# EAGLE design plc-accessory (EAGLE 8.6.3)
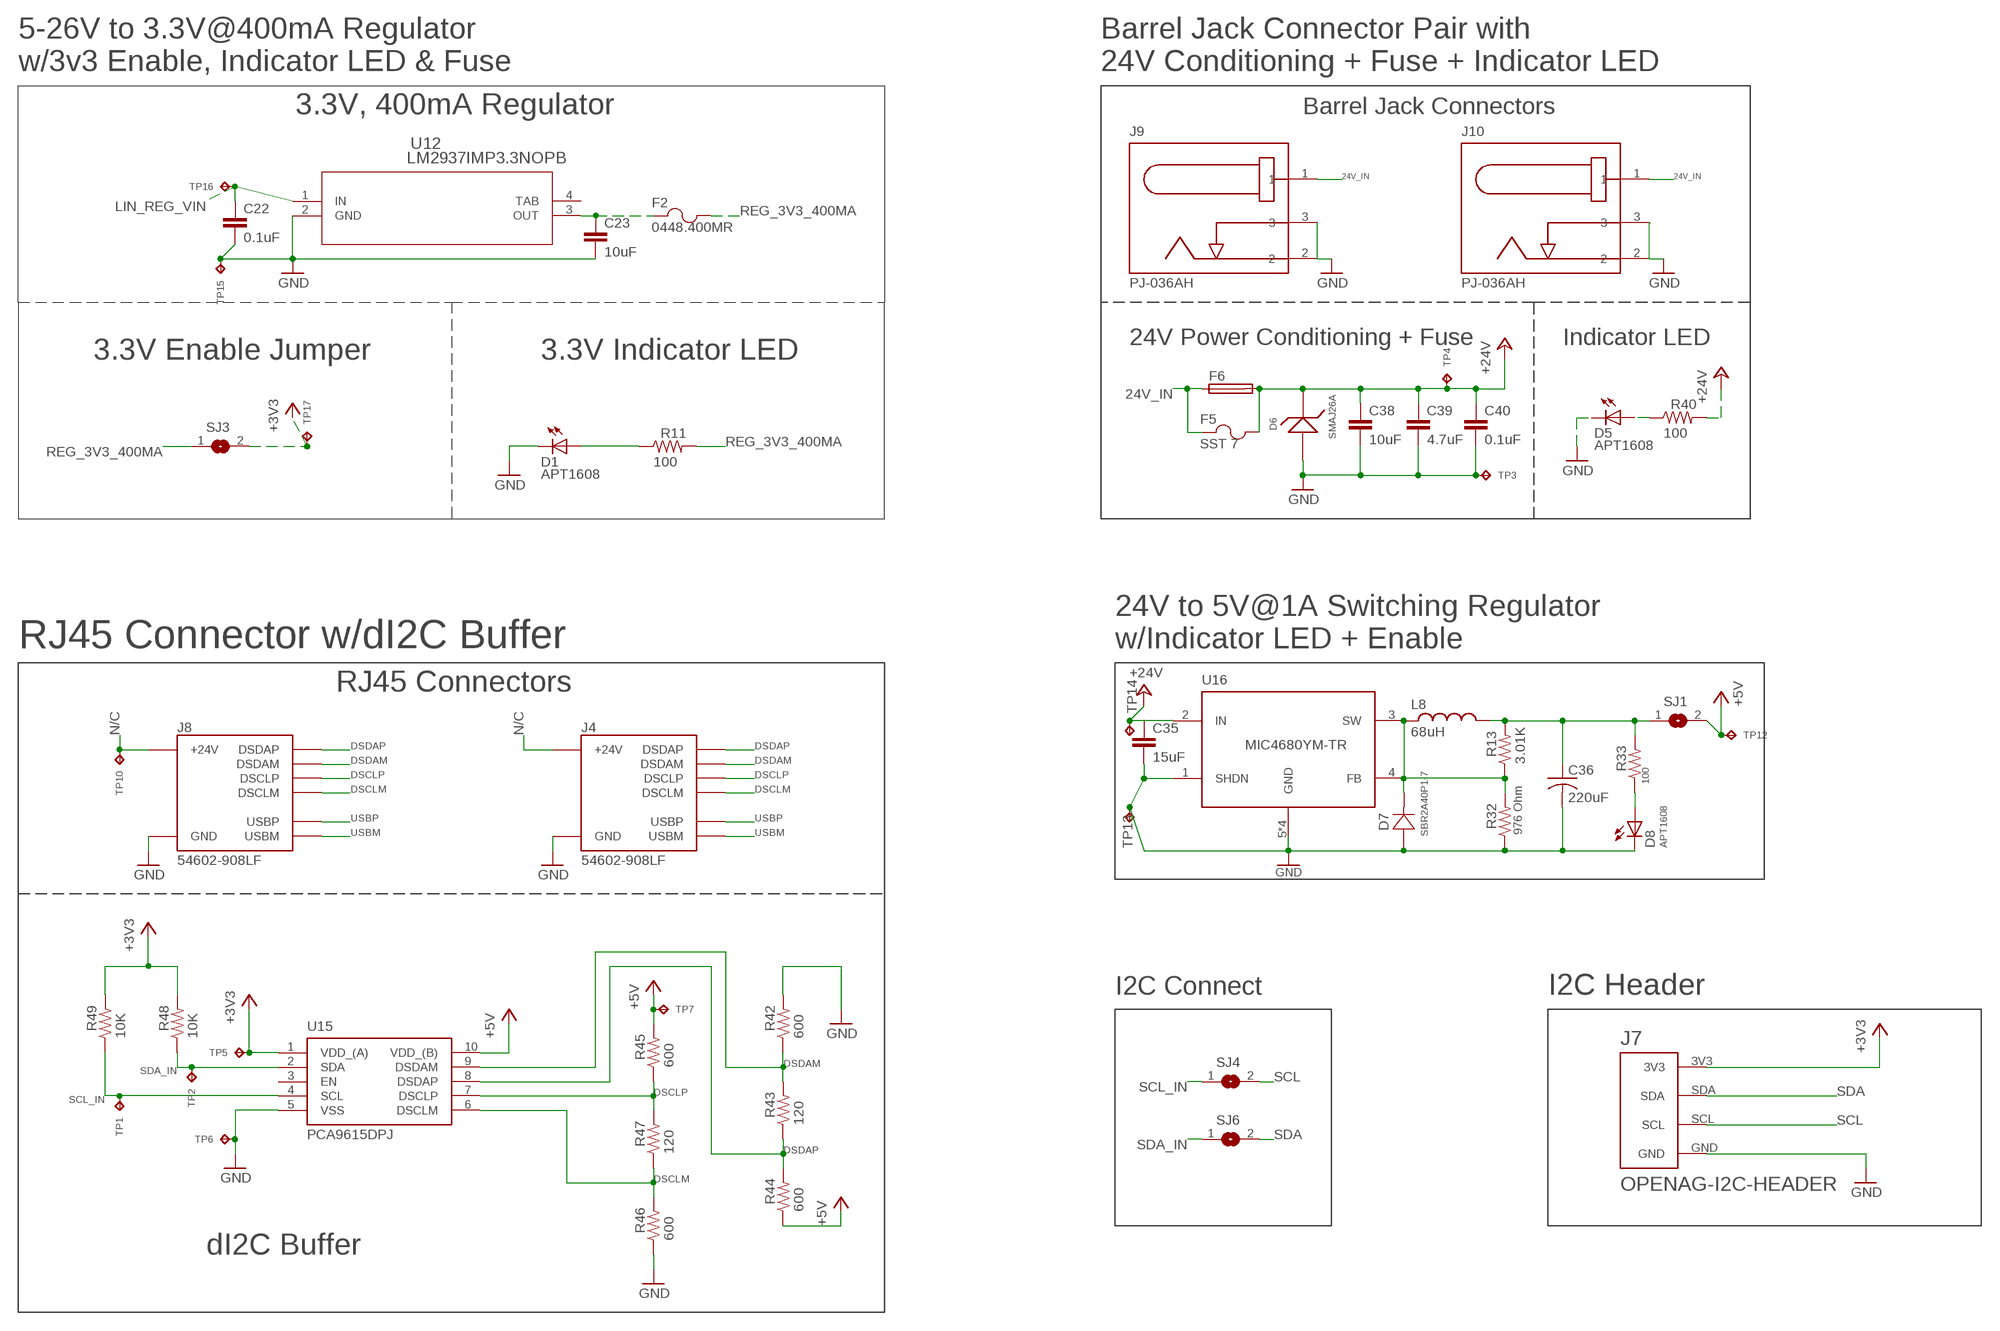
[diagram p0: schematic, sheet 1, part 1 of 2]
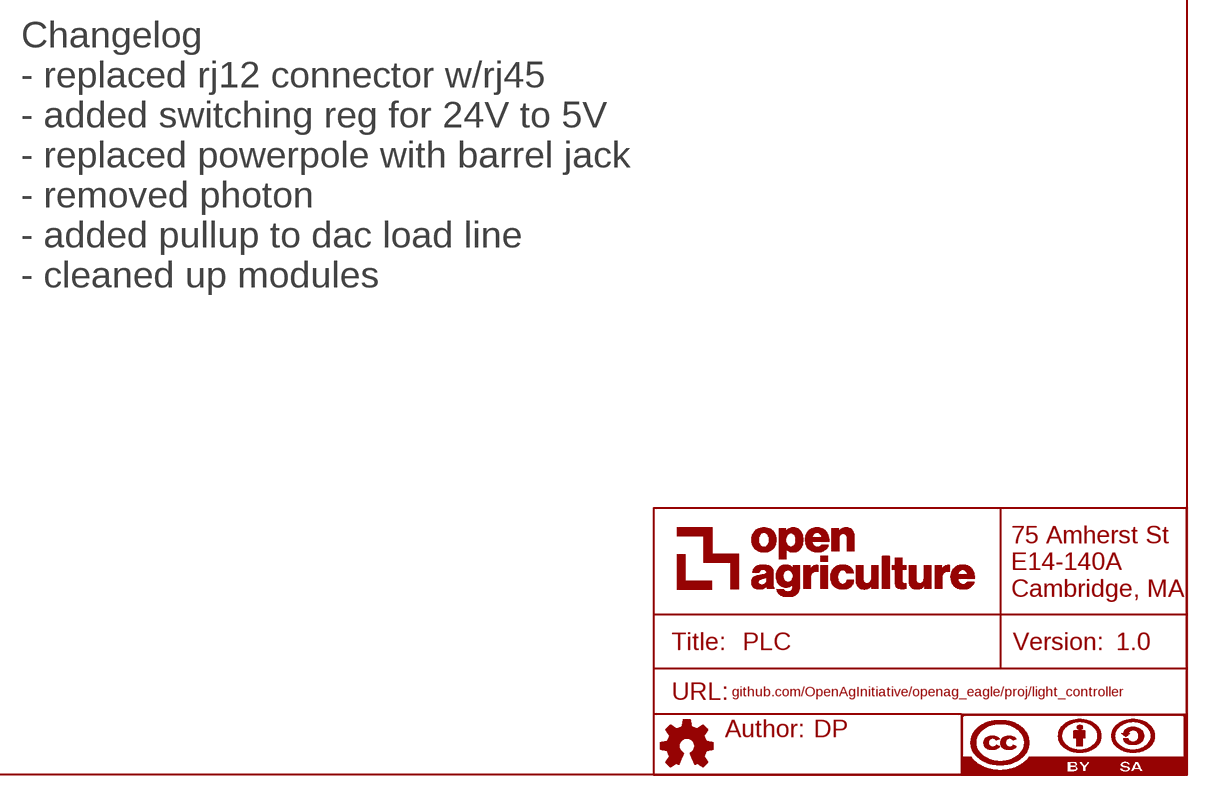
[diagram p1: schematic, sheet 1, part 2 of 2]

## Parts
C22  0.1uF  0.1UF-C0603C104K5RACTU  [C0603]
C23  10uF  10UF-GMK212BBJ106KG-T  [C0805]
C35  15uF  15UF-C2012X5R1V156M125AC  [C0805]
C36  220uF  220UF-TPSY227K010R0100  [CT7343]
C38  10uF  10UF-GMK212BBJ106KG-T  [C0805]
C39  4.7uF  4.7UF-CL21A475KBQNNNE  [C0805]
C40  0.1uF  0.1UF-C0603C104K5RACTU  [C0603]
D1  APT1608  APT1608CGCK  [CHIPLED_0603]
D5  APT1608  APT1608CGCK  [CHIPLED_0603]
D6  SMAJ26A  SMAJ26A-13-F  [SMA]
D7  SBR2A40P1-7  [POWERDI123]
D8  APT1608  APT1608CGCK  [CHIPLED_0603]
F2  0448.400MR  0438.375WR  [0603]
F5  SST 7  SST_7  [SS]
F6  GSH15  [GSH15]
FRAME1  DOCFIELD  [DOCFIELD]
J4  54602-908LF  OPENAG-V1-RJ45PTH  [OPENAG-V1-RJ45]
J7  OPENAG-I2C-HEADER  [OPENAG-I2C-HEADER]
J8  54602-908LF  OPENAG-V1-RJ45PTH  [OPENAG-V1-RJ45]
J9  PJ-036AH  PJ-036AH-SMT-TR  [PJ-036AH]
J10  PJ-036AH  PJ-036AH-SMT-TR  [PJ-036AH]
L8  68uH  68UH-UP2B-680-R  [UP2B]
R11  100  100OHM-RC0603JR-07100RL  [RC0603N]
R13  3.01K  3.01K-RC0603FR-073K01L  [RC0603N]
R32  976 Ohm  982OHM-RC0603FR-07976RL  [RC0603N]
R33  100  100OHM-RC0603JR-07100RL  [RC0603N]
R40  100  100OHM-RC0603JR-07100RL  [RC0603N]
R42  600  600OHM-RC0603FR-07604RL  [RC0603N]
R43  120  120OHM-RC0603FR-07120RL  [RC0603N]
R44  600  600OHM-RC0603FR-07604RL  [RC0603N]
R45  600  600OHM-RC0603FR-07604RL  [RC0603N]
R46  600  600OHM-RC0603FR-07604RL  [RC0603N]
R47  120  120OHM-RC0603FR-07120RL  [RC0603N]
R48  10K  10K-ERJ-3EKF1002V  [RC0603N]
R49  10K  10K-ERJ-3EKF1002V  [RC0603N]
SJ1  SOLDERJUMPERREFLOW_NOPASTE  [SOLDERJUMPER_REFLOW_NOPASTE]
SJ3  SOLDERJUMPERREFLOW_NOPASTE  [SOLDERJUMPER_REFLOW_NOPASTE]
SJ4  SOLDERJUMPERREFLOW_NOPASTE  [SOLDERJUMPER_REFLOW_NOPASTE]
SJ6  SOLDERJUMPERREFLOW_NOPASTE  [SOLDERJUMPER_REFLOW_NOPASTE]
TP1  TPTP06R  [TP06R]
TP2  TPTP06R  [TP06R]
TP3  TPTP06R  [TP06R]
TP4  TPTP06R  [TP06R]
TP5  TPTP06R  [TP06R]
TP6  TPTP06R  [TP06R]
TP7  TPTP06R  [TP06R]
TP10  TPTP06R  [TP06R]
TP12  TPTP06R  [TP06R]
TP13  TPTP06R  [TP06R]
TP14  TPTP06R  [TP06R]
TP15  TPTP06R  [TP06R]
TP16  TPTP06R  [TP06R]
TP17  TPTP06R  [TP06R]
U12  LM2937IMP3.3NOPB  LM2937IMP-3.3/NOPB  [MP04A]
U15  PCA9615DPJ  [SOP50P490X110-10N]
U16  MIC4680YM-TR  [SOIC8]

## Nets
24V_IN: F5.1 F6.1 J9.1 J10.1
+3V3: J7.3V3 R48.2 R49.2 SJ3.2 TP5.TP TP17.TP U15.1(VDD_(A))
+5V: R44.1 R45.2 SJ1.2 TP7.TP TP12.TP U15.10(VDD_(B))
+24V: C35.1 C38.1 C39.1 C40.1 D6.1 F5.2 F6.2 R40.2 TP4.TP TP14.TP U16.2(IN)
DSCLM: J4.DSCLM(5)(DSCLM) J8.DSCLM(5)(DSCLM) R46.2 R47.1 U15.6(DSCLM)
DSCLP: J4.DSCLP(4)(DSCLP) J8.DSCLP(4)(DSCLP) R45.1 R47.2 U15.7(DSCLP)
DSDAM: J4.DSDAM(2)(DSDAM) J8.DSDAM(2)(DSDAM) R42.1 R43.2 U15.9(DSDAM)
DSDAP: J4.DSDAP(1)(DSDAP) J8.DSDAP(1)(DSDAP) R43.1 R44.2 U15.8(DSDAP)
GND: C22.2 C23.2 C35.2 C36.-(2(-)) C38.2 C39.2 C40.2 D1.C D5.C D6.2 D7.- D8.C J4.GND(3)(GND) J7.GND J8.GND(3)(GND) J9.2 J9.3 J10.2 J10.3 R32.1 R42.2 R46.1 TP3.TP TP6.TP TP13.TP TP15.TP U12.2(GND) U15.5(VSS) U16.1(SHDN) U16.5(GND) U16.6(GND) U16.7(GND) U16.8(GND)
LIN_REG_VIN: C22.1 TP16.TP U12.1(IN)
N$10: D1.A R11.1
N$11: D7.+ L8.1 R13.1 R32.2 U16.3(SW) U16.4(FB)
N$12: C23.1 F2.1 U12.3(OUT)
N$22: D8.A R33.1
N$24: C36.+(1(+)) L8.2 R13.2 R33.2 SJ1.1
N$26: D5.A R40.1
N/C: J4.24V(6)(+24V) J8.24V(6)(+24V) TP10.TP
REG_3V3_400MA: F2.2 R11.2 SJ3.1
SCL: J7.SCL SJ4.2
SCL_IN: R49.1 SJ4.1 TP1.TP U15.4(SCL)
SDA: J7.SDA SJ6.2
SDA_IN: R48.1 SJ6.1 TP2.TP U15.2(SDA)
USBM: J4.USBM(8)(USBM) J8.USBM(8)(USBM)
USBP: J4.USBP(7)(USBP) J8.USBP(7)(USBP)
Unconnected: U15.3(EN)

## Notes on the sheet
- 5-26V to 3.3V@400mA Regulator 
  w/3v3 Enable, Indicator LED & Fuse
- Barrel Jack Connector Pair with 
  24V Conditioning + Fuse + Indicator LED
- 3.3V, 400mA Regulator | Barrel Jack Connectors
- 24V Power Conditioning + Fuse | Indicator LED
- 3.3V Enable Jumper | 3.3V Indicator LED
- RJ45 Connector w/dI2C Buffer
- 24V to 5V@1A Switching Regulator
  w/Indicator LED + Enable
- RJ45 Connectors
- I2C Connect | I2C Header
- dI2C Buffer
- Changelog
  - replaced rj12 connector w/rj45
  - added switching reg for 24V to 5V
  - replaced powerpole with barrel jack
  - removed photon
  - added pullup to dac load line
  - cleaned up modules

## Power pins joined to a net without a drawn wire
TAB: U12.4(TAB)

## Library data of the parts
C22 C40 = openag-capacitors:0.1UF-C0603C104K5RACTU: Kemet - C0603C104K5RACTU - CAP CER 0.1UF 50V X7R 0603 Description: 0.1µF ±10% 50V Ceramic Capacitor X7R 0603 (1608 Metric) Technical Specifications: Capacitance: 0.1µF Tolerance: ±10% Rated Voltage: 50V Temperature Coefficient: X7R Operating Temperature: -55°C ~ 125°C Package / Case: 0603 (1608 Metric) Datasheet(s): X7R Dielectric, 6.3-250 VDC <https://search.kemet.com/component-edge/download/datasheet/C0603C104K5RACTU.pdf> Vendor(s): Digikey: 399-5089-1-ND <https://www.digikey.com/product-detail/en/kemet/C0603C104K5RACTU/399-5089-1-ND/1465623>; POPULATE: YES; VERIFIED: NO
C23 C38 = openag-capacitors:10UF-GMK212BBJ106KG-T: Taiyo Yuden - GMK212BBJ106KG-T - CAP CER 10UF 35V X5R 0805 Description: 10µF ±10% 35V Ceramic Capacitor X5R 0805 (2012 Metric) Technical Specifications: Capacitance: 10µF Tolerance: ±10% Rated Voltage: 35V Temperature Coefficient: X5R Operating Temperature: -55°C ~ 85°C Package / Case: 0805 (2012 Metric) Datasheet(s): GMK212BBJ106KG-T Spec <http://ds.yuden.co.jp/TYCOMPAS/ut/detail.do?productNo=GMK212BBJ106KG-T&fileName=GMK212BBJ106KG-T_SS&mode=specSheetDownload> Vendor(s): Digikey: 587-4893-1-ND <https://www.digikey.com/product-detail/en/taiyo-yuden/GMK212BBJ106KG-T/587-4893-1-ND/6563736>; POPULATE: YES; VERIFIED: NO
C35 = openag-capacitors:15UF-C2012X5R1V156M125AC: TDK Corporation - C2012X5R1V156M125AC - CAP CER 15UF 35V X5R 0805 Description: 15µF ±20% 35V Ceramic Capacitor X5R 0805 (2012 Metric) Technical Specifications: Capacitance: 15µF Tolerance: ±20% Voltage - Rated: 35V Temperature Coefficient: X5R Operating Temperature: -55°C ~ 85°C Features: Low ESL Applications: General Purpose Mounting Type: Surface Mount, MLCC Package / Case: 0805 (2012 Metric) Size / Dimension: 0.079" L x 0.049" W (2.00mm x 1.25mm) Thickness (Max): 0.057" (1.45mm) Datasheet(s): C Series, General Datasheet <https://product.tdk.com/info/en/catalog/datasheets/mlcc_commercial_general_en.pdf> MLCC Part Number Guide <https://product.tdk.com/en/products/common/pdf/mlcc_partnumber_description.pdf> C Series, Gen Appl & Mid-Voltage Spec <https://product.tdk.com/info/en/catalog/spec/mlccspec_commercial_general_midvoltage_en.pdf> Vendor(s): Digikey: 445-14423-1-ND <https://www.digikey.com/product-detail/en/tdk-corporation/C2012X5R1V156M125AC/445-14423-1-ND/3956089>
C36 = openag-capacitors:220UF-TPSY227K010R0100: AVX Corporation - TPSY227K010R0100 - CAP TANT 220UF 10V 10% 2917 Description: 220µF Molded Tantalum Capacitors 10V 2917 (7343 Metric) 100 mOhm Technical Specifications: Capacitance: 220µF Tolerance: ±10% Voltage - Rated: 10V Type: Molded ESR (Equivalent Series Resistance): 100 mOhm Operating Temperature: -55°C ~ 125°C Mounting Type: Surface Mount Package / Case: 2917 (7343 Metric) Size / Dimension: 0.287" L x 0.169" W (7.30mm x 4.30mm) Height - Seated (Max): 0.079" (2.00mm) Manufacturer Size Code: Y Features: General Purpose Datasheet(s): TPS Series, Low ESR <http://datasheets.avx.com/TPS.pdf> Vendor(s): Digikey: 478-5408-1-ND <https://www.digikey.com/scripts/DkSearch/dksus.dll?Detail&itemSeq=250948888&uq=636531796868737363>
C39 = openag-capacitors:4.7UF-CL21A475KBQNNNE: Samsung - CL21A475KBQNNNE - CAP CER 4.7UF 50V X5R 0805 Description: 4.7µF ±10% 50V Ceramic Capacitor X5R 0805 (2012 Metric) Technical Specifications: Capacitance: 4.7uF Tolerance: ±10% Rated Voltage: 50V Temperature Coefficient: X5R Operating Temperature: -55°C ~ 85°C Package/Case: 0805 (2012 Metric) Datasheet(s): CL21A475KBQNNNE Characteristics <http://www.samsungsem.com/kr/front/downloadcms.do?path=/kr/support/product-search/mlcc/__icsFiles/afieldfile/2014/11/05&fileName=C_CL21A475KBQNNNE.pdf> Vendor(s): Digikey: 1276-1248-1-ND <https://www.digikey.com/product-detail/en/samsung-electro-mechanics/CL21A475KBQNNNE/1276-1248-1-ND/3889334>; POPULATE: YES; VERIFIED: NO
D1 D5 D8 = openag-diodes:APT1608CGCK: Kingbright - APT1608CGCK - LED GREEN CLEAR 0603 SMD Description: Green 570nm LED Indication - Discrete 2.1V 0603 (1608 Metric) Technical Specifications: Color: Green Lens Color: Colorless Lens Transparency: Clear Millicandela Rating: 50mcd Lens Style/Size: Rectangle with Flat Top, 1.20mm x 0.80mm Voltage - Forward (Vf) (Typ): 2.1V Current - Test: 20mA Viewing Angle: 120° Mounting Type: Surface Mount Wavelength - Dominant: 570nm Wavelength - Peak: 574nm Package / Case: 0603 (1608 Metric) Supplier Device Package: Chip LED Size / Dimension: 1.60mm L x 0.80mm W Height (Max): 0.75mm Datasheet(s): APT1608CGCK <http://www.kingbrightusa.com/images/catalog/SPEC/APT1608CGCK.pdf> Vendor(s): Digikey: 754-1116-1-ND <https://www.digikey.com/product-detail/en/kingbright/APT1608CGCK/754-1116-1-ND/1747833#>; POPULATE: YES; VERIFIED: NO
D6 = openag-diodes:SMAJ26A-13-F: Diodes Incorporated - SMAJ26A-13-F - TVS DIODE 26VWM 42.1VC SMA Description: TVS DIODE 26VWM 42.1VC SMA Technical Specifications: Type: Zener Voltage - Reverse Standoff (Typ): 26V Voltage - Breakdown (Min): 28.9V Voltage - Clamping (Max) @ Ipp: 42.1V Current - Peak Pulse (10/1000µs): 9.5A Power - Peak Pulse: 400W Power Line Protection: No Operating Temperature: -55°C ~ 150°C (TJ) DO-214AC, SMA Datasheet(s): SMAJ5.0(C)A - SMAJ200(C)A Vendor(s): Digikey: SMAJ26A-FDICT-ND <https://www.digikey.com/product-detail/en/diodes-incorporated/SMAJ26A-13-F/SMAJ26A-FDICT-ND/806583>
D7 = openag-diodes:SBR2A40P1-7: Diodes Incorporated - SBR2A40P1-7 - DIODE SBR 40V 2A POWERDI123 Description: Diode Super Barrier 40V 2A Surface Mount PowerDI™ 123 Technical Specifications: Diode Type: Super Barrier Voltage - DC Reverse (Vr) (Max): 40V Current - Average Rectified (Io): 2A Voltage - Forward (Vf) (Max) @ If: 500mV @ 2A Speed: Standard Recovery >500ns, > 200mA (Io) Current - Reverse Leakage @ Vr: 100µA @ 40V Mounting Type: Surface Mount Package / Case: POWERDI®123 Supplier Device Package: PowerDI™ 123 Operating Temperature - Junction: -65°C ~ 150°C Base Part Number: SBR2A40 Datasheet(s): SBR2A40P1 <https://www.diodes.com/assets/Datasheets/SBR2A40P1.pdf> Vendor(s): Digikey: SBR2A40P1DITR-ND <https://www.digikey.com/product-detail/en/diodes-incorporated/SBR2A40P1-7/SBR2A40P1DITR-ND/1681825>
F2 = openag-fuses:0438.375WR: Littelfuse Inc. - 0448.400MR - FUSE BOARD MNT 400MA 125VAC/VDC Description: FUSE BOARD MNT 400MA 125VAC/VDC Technical Specifications: Fuse Type: Board Mount (Cartridge Style Excluded) Current Rating: 400mA Voltage Rating - AC: 125V Voltage Rating - DC: 125V Response Time: Fast Package / Case: 2-SMD, Square End Block Mounting Type: Surface Mount Breaking Capacity @ Rated Voltage: 50A Melting I²t: 0.0416 Approvals: CSA, UL Operating Temperature: -55°C ~ 125°C Size / Dimension: 0.240" L x 0.106" W x 0.106" H (6.10mm x 2.69mm x 2.69mm) DC Cold Resistance: 0.4895 Ohms Datasheet(s): 448 Series Datasheet <http://www.littelfuse.com/~/media/electronics/datasheets/fuses/littelfuse_fuse_448_datasheet.pdf.pdf> Vendor(s): Digikey: F5573CT-ND <https://www.digikey.com/product-detail/en/littelfuse-inc/0448.400MR/F5573CT-ND/3306934>; POPULATE: YES; VERIFIED: YES
F5 = openag-fuses:SST_7: Bel Fuse - SST7 - FUSE BRD MNT 7A 125VAC/VDC 2SMD Description: FUSE BRD MNT 7A 125VAC/VDC 2SMD Technical Specifications: Current Rating: 7A Voltage Rating: 125V Fuse Type: Board Mount (Cartridge Style Excluded) Mounting Type: Surface Mount Operating Temperature: -55°C ~ 125°C Datasheet(s): SST Type <https://belfuse.com/resources/StewartConnector/SST.pdf> Vendor(s): Digikey: 507-1072-1-ND <https://www.digikey.com/product-detail/en/bel-fuse-inc/SST-7/507-1072-1-ND/615026>; POPULATE: YES; VERIFIED: NO
F6 = fuse:GSH15: FUSE HOLDER grid 15mm, 19649 Wickmann; MPN: 64900001039; OC_FARNELL: 1271673; OC_NEWARK: 02P0318
FRAME1 = openag-frames:DOCFIELD: DOCUMENT FIELD; AUTHOR: DP; DESCRIPTION: PLC; TITLE: PLC; URL: github.com/OpenAgInitiative/openag_eagle/proj/light_controller; VER: 1.0
J4 J8 = openag_connector:OPENAG-V1-RJ45: Amphenol FCI - 54602-908LF - CONN MOD JACK 8P8C R/A UNSHLD Description: Jack Modular Connector 8p8c (RJ45, Ethernet) 90� Angle (Right) Unshielded Cat3 Technical Specifications: Connector Type: Jack Number of Positions/Contacts: 8p8c (RJ45, Ethernet) Number of Ports: 1 Number of Rows: 1 Mounting Type: Through Hole Orientation: 90� Angle (Right) Termination: Solder Shielding: Unshielded Ratings: Cat3 Features: Board Lock LED Color: Does Not Contain LED Tab Direction: Down Contact Material: Copper Alloy Contact Finish: Gold Contact Finish Thickness: 15�in (0.38�m) Housing Material: Polyester, Glass Filled Operating Temperature: -40�C ~ 70�C Datasheet(s): 54601-x04(zzz)WPLF Drawing <http://cdn.amphenol-icc.com/media/wysiwyg/files/drawing/c-bmj-0102.pdf> Vendor(s): Digikey: 609-1046-ND <https://www.digikey.com/product-detail/en/amphenol-fci/54602-908LF/609-1046-ND/1001360>; POPULATE: YES; VERIFIED: NO
J7 = openag-connectors:OPENAG-I2C-HEADER: Fits standard 100 mil header footprint; POPULATE: NO; VERIFIED: NO
J9 J10 = openag-connectors:PJ-036AH-SMT-TR: CUI Inc. - PJ-036AH-SMT-TR - CONN PWR JACK 2X5.5MM SOLDER Description: Power Barrel Connector Jack 2.10mm ID (0.083"), 5.50mm OD (0.217") Surface Mount, Right Angle Technical Specifications: Connector Type: Jack Gender: Male Industry Recognized Mating Diameter: 2.10mm ID (0.083"), 5.50mm OD (0.217") Actual Diameter: 0.078" (2.00mm ID), 0.248" (6.30mm OD) Number of Positions/Contacts: 2 Conductors, 3 Contacts Internal Switch(s): Single Switch, Normally Closed Mounting Type: Surface Mount, Right Angle Termination: Solder Shielding: Unshielded Voltage - Rated: 24VDC Current Rating: 5A Mating Length/Depth: 0.360" (9.15mm) Contact Material - Plating: Silver Operating Temperature: -25°C ~ 85°C Housing Material: Polyamide (PA6T), Nylon 6T Contact Material: Brass; Copper Alloy Body Color: Black Datasheet(s): PJ-036AH-SMT-TR <http://www.cui.com/product/resource/digikeypdf/pj-036ah-smt-tr.pdf> Vendor(s): Digikey: CP-036AHPJCT-ND <https://www.digikey.com/product-detail/en/cui-inc/PJ-036AH-SMT-TR/CP-036AHPJCT-ND/1530994>
L8 = openag-inductors:68UH-UP2B-680-R: Eaton - UP2B-680-R - FIXED IND 68UH 1.5A 178.7 MOHM Description: 68µH Unshielded Wirewound Inductor 1.5A 178.7 mOhm Max Nonstandard Technical Specifications: Type: Wirewound Material - Core: Ferrite Inductance: 68µH Tolerance: ±20% Current Rating: 1.5A Current - Saturation: 1.2A Shielding: Unshielded DC Resistance (DCR): 178.7 mOhm Max Operating Temperature: -40°C ~ 85°C Frequency - Test: 100kHz Mounting Type: Surface Mount Package / Case: Nonstandard Size / Dimension: 0.550" L x 0.410" W (13.97mm x 10.41mm) Height - Seated (Max): 0.236" (6.00mm) Datasheet(s): UNI-PAC (-R) <http://www.cooperindustries.com/content/dam/public/bussmann/Electronics/Resources/product-datasheets/BUS_Elx_PM_4308_UNI_PAC_Power_Inductors.pdf> Vendor(s): Digikey: 513-1083-1-ND <https://www.digikey.com/scripts/DkSearch/dksus.dll?Detail&itemSeq=250945518&uq=636531821133403587>
R11 R33 R40 = openag-resistors:100OHM-RC0603JR-07100RL: Yageo - RC0603JR-07100RL - RES SMD 100 OHM 5% 1/10W 0603 Description: 100 Ohms ±5% 0.1W, 1/10W Chip Resistor 0603 (1608 Metric) Moisture Resistant Thick Film Technical Specifications: Resistance: 100 Ohms Tolerance: ±5% Power (Watts): 0.1W, 1/10W Composition: Thick Film Features: Moisture Resistant Temperature Coefficient: ±100ppm/°C Operating Temperature: -55°C ~ 155°C Package / Case: 0603 (1608 Metric) Supplier Device Package: 0603 Size / Dimension: 0.063" L x 0.032" W (1.60mm x 0.80mm) Height - Seated (Max): 0.022" (0.55mm) Number of Terminations: 2 Datasheet(s): Thick Film Chip Resistor Intro <http://www.yageo.com.tw/exep/pages/download/literatures/PYu-R_INT-thick_7.pdf> Chip Resistor Marking <http://www.yageo.com/exep/pages/download/literatures/PYu-R_Marking_2.pdf> RC Series, L Datasheet <http://www.yageo.com/documents/recent/PYu-RC_Group_51_RoHS_L_8.pdf> Vendor(s): Digikey: 311-100GRCT-ND <https://www.digikey.com/product-detail/en/yageo/RC0603JR-07100RL/311-100GRCT-ND/729644>; POPULATE: YES; VERIFIED: NO
R13 = openag-resistors:3.01K-RC0603FR-073K01L: Yageo - RC0603FR-073K01L - RES SMD 3.01K OHM 1% 1/10W 0603 Description: 3.01 kOhms ±1% 0.1W, 1/10W Chip Resistor 0603 (1608 Metric) Moisture Resistant Thick Film Technical Specifications: Resistance: 3.01 kOhms Tolerance: ±1% Power (Watts): 0.1W, 1/10W Composition: Thick Film Features: Moisture Resistant Temperature Coefficient: ±100ppm/°C Operating Temperature: -55°C ~ 155°C Package / Case: 0603 (1608 Metric) Supplier Device Package: 0603 Size / Dimension: 0.063" L x 0.032" W (1.60mm x 0.80mm) Height - Seated (Max): 0.022" (0.55mm) Number of Terminations: 2 Datasheet(s): Chip Resistor Marking <http://www.yageo.com/exep/pages/download/literatures/PYu-R_Marking_2.pdf> RC Series, L Datasheet <http://www.yageo.com/documents/recent/PYu-RC_Group_51_RoHS_L_8.pdf> Vendor(s): Digikey: 311-3.01KHRCT-ND <https://www.digikey.com/scripts/DkSearch/dksus.dll?Detail&itemSeq=250949714&uq=636531832410541188>
R32 = openag-resistors:982OHM-RC0603FR-07976RL: Yageo - RC0603FR-07976RL - RES SMD 976 OHM 1% 1/10W 0603 Description: 976 Ohms ±1% 0.1W, 1/10W Chip Resistor 0603 (1608 Metric) Moisture Resistant Thick Film Technical Specifications: Resistance: 976 Ohms Tolerance: ±1% Power (Watts): 0.1W, 1/10W Composition: Thick Film Features: Moisture Resistant Temperature Coefficient: ±100ppm/°C Operating Temperature: -55°C ~ 155°C Package / Case: 0603 (1608 Metric) Supplier Device Package: 0603 Size / Dimension: 0.063" L x 0.032" W (1.60mm x 0.80mm) Height - Seated (Max): 0.022" (0.55mm) Number of Terminations: 2 Datasheet(s): Chip Resistor Marking <http://www.yageo.com/exep/pages/download/literatures/PYu-R_Marking_2.pdf> RC Series, L Datasheet <http://www.yageo.com/documents/recent/PYu-RC_Group_51_RoHS_L_8.pdf> Vendor(s): Digikey: 311-976HRCT-ND <https://www.digikey.com/scripts/DkSearch/dksus.dll?Detail&itemSeq=250949870&uq=636531835229553061>
R42 R44-R46 = openag-resistors:600OHM-RC0603FR-07604RL: Yageo - RC0603FR-07604RL - RES SMD 604 OHM 1% 1/10W 0603 Description: 604 Ohms ±1% 0.1W, 1/10W Chip Resistor 0603 (1608 Metric) Moisture Resistant Thick Film Technical Specifications: Resistance: 604 Ohms Tolerance: ±1% Power (Watts): 0.1W, 1/10W Composition: Thick Film Features: Moisture Resistant Temperature Coefficient: ±100ppm/°C Operating Temperature: -55°C ~ 155°C Package / Case: 0603 (1608 Metric) Supplier Device Package: 0603 Size / Dimension: 0.063" L x 0.032" W (1.60mm x 0.80mm) Height - Seated (Max): 0.022" (0.55mm) Number of Terminations: 2 Datasheet(s): RC Series, L Datasheet <http://www.yageo.com/documents/recent/PYu-RC_Group_51_RoHS_L_8.pdf> Chip Resistor Marking <http://www.yageo.com/exep/pages/download/literatures/PYu-R_Marking_2.pdf> Vendor(s): Digikey: 311-604HRCT-ND <https://www.digikey.com/product-detail/en/yageo/RC0603FR-07604RL/311-604HRCT-ND/730276>
R43 R47 = openag-resistors:120OHM-RC0603FR-07120RL: Yageo - RC0603FR-07120RL - RES SMD 120 OHM 1% 1/10W 0603 Description: 120 Ohms ±1% 0.1W, 1/10W Chip Resistor 0603 (1608 Metric) Moisture Resistant Thick Film Technical Specifications: Resistance: 120 Ohms Tolerance: ±1% Power (Watts): 0.1W, 1/10W Composition: Thick Film Features: Moisture Resistant Temperature Coefficient: ±100ppm/°C Operating Temperature: -55°C ~ 155°C Package / Case: 0603 (1608 Metric) Supplier Device Package: 0603 Size / Dimension: 0.063" L x 0.032" W (1.60mm x 0.80mm) Height - Seated (Max): 0.022" (0.55mm) Number of Terminations: 2 Datasheet(s): RC Series, L Datasheet <http://www.yageo.com/documents/recent/PYu-RC_Group_51_RoHS_L_8.pdf> Chip Resistor Marking <http://www.yageo.com/exep/pages/download/literatures/PYu-R_Marking_2.pdf> Vendor(s): Digikey: 311-120HRCT-ND <https://www.digikey.com/product-detail/en/yageo/RC0603FR-07120RL/311-120HRCT-ND/729867>
R48 R49 = openag-resistors:10K-ERJ-3EKF1002V: Panasonic - ERJ-3EKF1002V - RES SMD 10K OHM 1% 1/10W 0603 Description: 10 kOhms ±1% 0.1W, 1/10W Chip Resistor 0603 (1608 Metric) Automotive AEC-Q200 Thick Film Technical Specifications: Resistance: 10kOhms Tolerance: ±1% Power: 0.1W, 1/10W Operating Temperature: -55°C ~ 155°C Package/Case: 0603 (1608 Metric) Datasheet(s): ERJ-3EKF1002V View All Specifications <https://industrial.panasonic.com/ww/products/resistors/chip-resistors/general-purpose-chip-resistors/precision-thick-film-chip-resistors/ERJ3EKF1002V> Vendor(s): Digikey: P10.0KHCT-ND <https://www.digikey.com/product-detail/en/panasonic-electronic-components/ERJ-3EKF1002V/P10.0KHCT-ND/198102>; POPULATE: YES; VERIFIED: NO
SJ1 SJ3 SJ4 SJ6 = openag-connectors:SOLDERJUMPER: SMD Solder JUMPER Solder the two pads together to create a connection, or remove the solder to break it. REFLOW - Use this footprint for solder paste and reflow ovens. WAVE - Use this footprint for hand-soldering (larger pads). CLOSED - Has a trace between the two pads to ensure it is closed by default. The trace needs to be cut to disable the jumper, and can be closed again by creating a solder bridge between the two pads.; POPULATE: YES; VERIFIED: NO
TP1-TP7 TP10 TP12-TP17 = openag-testpads:TP: Test pad
U12 = openag-regulators:LM2937IMP-3.3/NOPB: Texas Instruments - LM2937IMP-3.3/NOPB - IC REG LIN 3.3V 400MA SOT223-4 Description: Linear Voltage Regulator IC Positive Fixed 1 Output 3.3V 400mA SOT-223-4 Technical Specifications: Output Configuration: Positive Output Type: Fixed Number of Regulators: 1 Voltage - Input (Max): 26V Voltage - Output (Min/Fixed): 3.3V Voltage Dropout (Max): 1V @ 50mA Current - Output: 400mA Current - Quiescent (Iq): 2mA Current - Supply (Max): 1.25A Protection Features: Over Temperature, Reverse Polarity, Short Circuit Operating Temperature: -40°C ~ 85°C Mounting Type: Surface Mount Package / Case: TO-261-4, TO-261AA Supplier Device Package: SOT-223-4 Base Part Number: LM2937 Datasheet(s): LM2937-2.5, LM2937-3.3 Datasheet <http://www.ti.com/lit/ds/symlink/lm2937-2.5.pdf> Vendor(s): Digikey: LM2937IMP-3.3/NOPBCT-ND <https://www.digikey.com/product-detail/en/texas-instruments/LM2937IMP-3.3-NOPB/LM2937IMP-3.3-NOPBCT-ND/270742#>; POPULATE: YES; VERIFIED: NO
U15 = openag-buffers:PCA9615DPJ: NXP USA Inc. - PCA9615DPJ - IC REDRIVER I2C 2CH 10TSSOP Description: Buffer, ReDriver 2 Channel 400kHz 10-TSSOP Technical Specifications: Type: Buffer, ReDriver Applications: I²C Input: 2-Wire Bus Output: 2-Wire Bus Data Rate (Max): 400kHz Number of Channels: 2 Capacitance - Input: 7pF Voltage - Supply: 2.3 V ~ 5.5 V Current - Supply: 16µA Operating Temperature: -40°C ~ 85°C Package / Case: 10-TFSOP, 10-MSOP (0.118", 3.00mm Width) Supplier Device Package: 10-TSSOP Base Part Number: PCA9615 Datasheet(s): PCA9615DP <http://www.nxp.com/documents/data_sheet/PCA9615.pdf> Vendor(s): Digikey: 568-11484-1-ND <https://www.digikey.com/product-detail/en/nxp-usa-inc/PCA9615DPJ/568-11484-1-ND/4864508>
U16 = openag-regulators:MIC4680YM-TR: Microchip Technology - MIC4680YM-TR - IC REG BUCK BOOST ADJ 1.3A 8SOIC Description: Buck, Buck-Boost Switching Regulator IC Positive Adjustable 1.23V 1 Output 1.3A 8-SOIC (0.154", 3.90mm Width) Technical Specifications: Function: Step-Down, Step-Up/Step-Down Output Configuration: Positive Topology: Buck, Buck-Boost Output Type: Adjustable Number of Outputs: 1 Voltage - Input (Min): 4V Voltage - Input (Max): 34V Voltage - Output (Min/Fixed): 1.23V Voltage - Output (Max): 32.98V Current - Output: 1.3A Frequency - Switching: 200kHz Synchronous Rectifier: No Operating Temperature: -40°C ~ 125°C (TJ) Mounting Type: Surface Mount Package / Case: 8-SOIC (0.154", 3.90mm Width) Supplier Device Package: 8-SOIC Base Part Number: MIC4680 Datasheet(s): MIC4680 <http://www.microchip.com/mymicrochip/filehandler.aspx?ddocname=en579250> Vendor(s): Digikey: 576-1222-1-ND <https://www.digikey.com/scripts/DkSearch/dksus.dll?Detail&itemSeq=250950999&uq=636531791983475304>

## Board
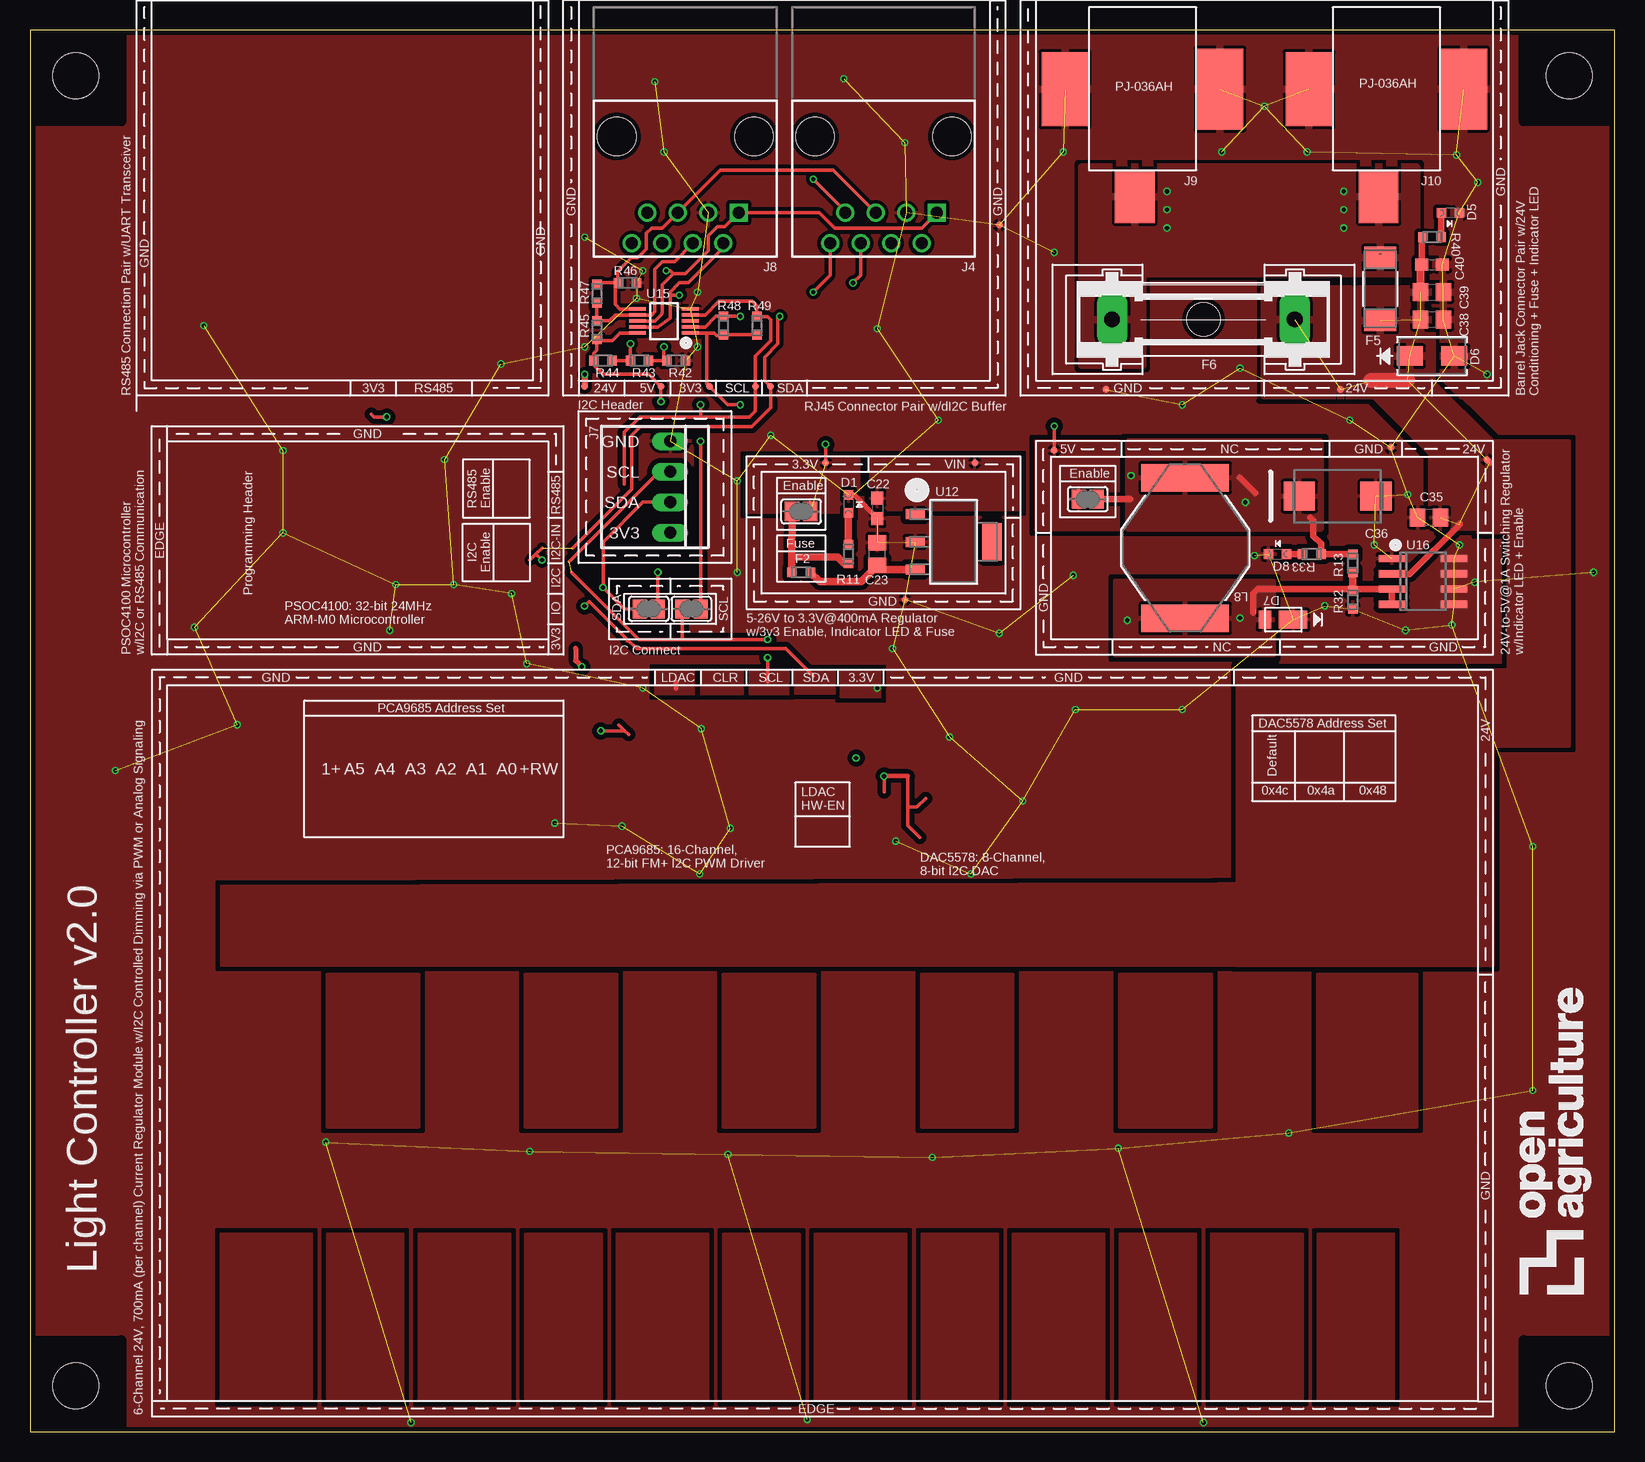
[diagram p2: board, top side]
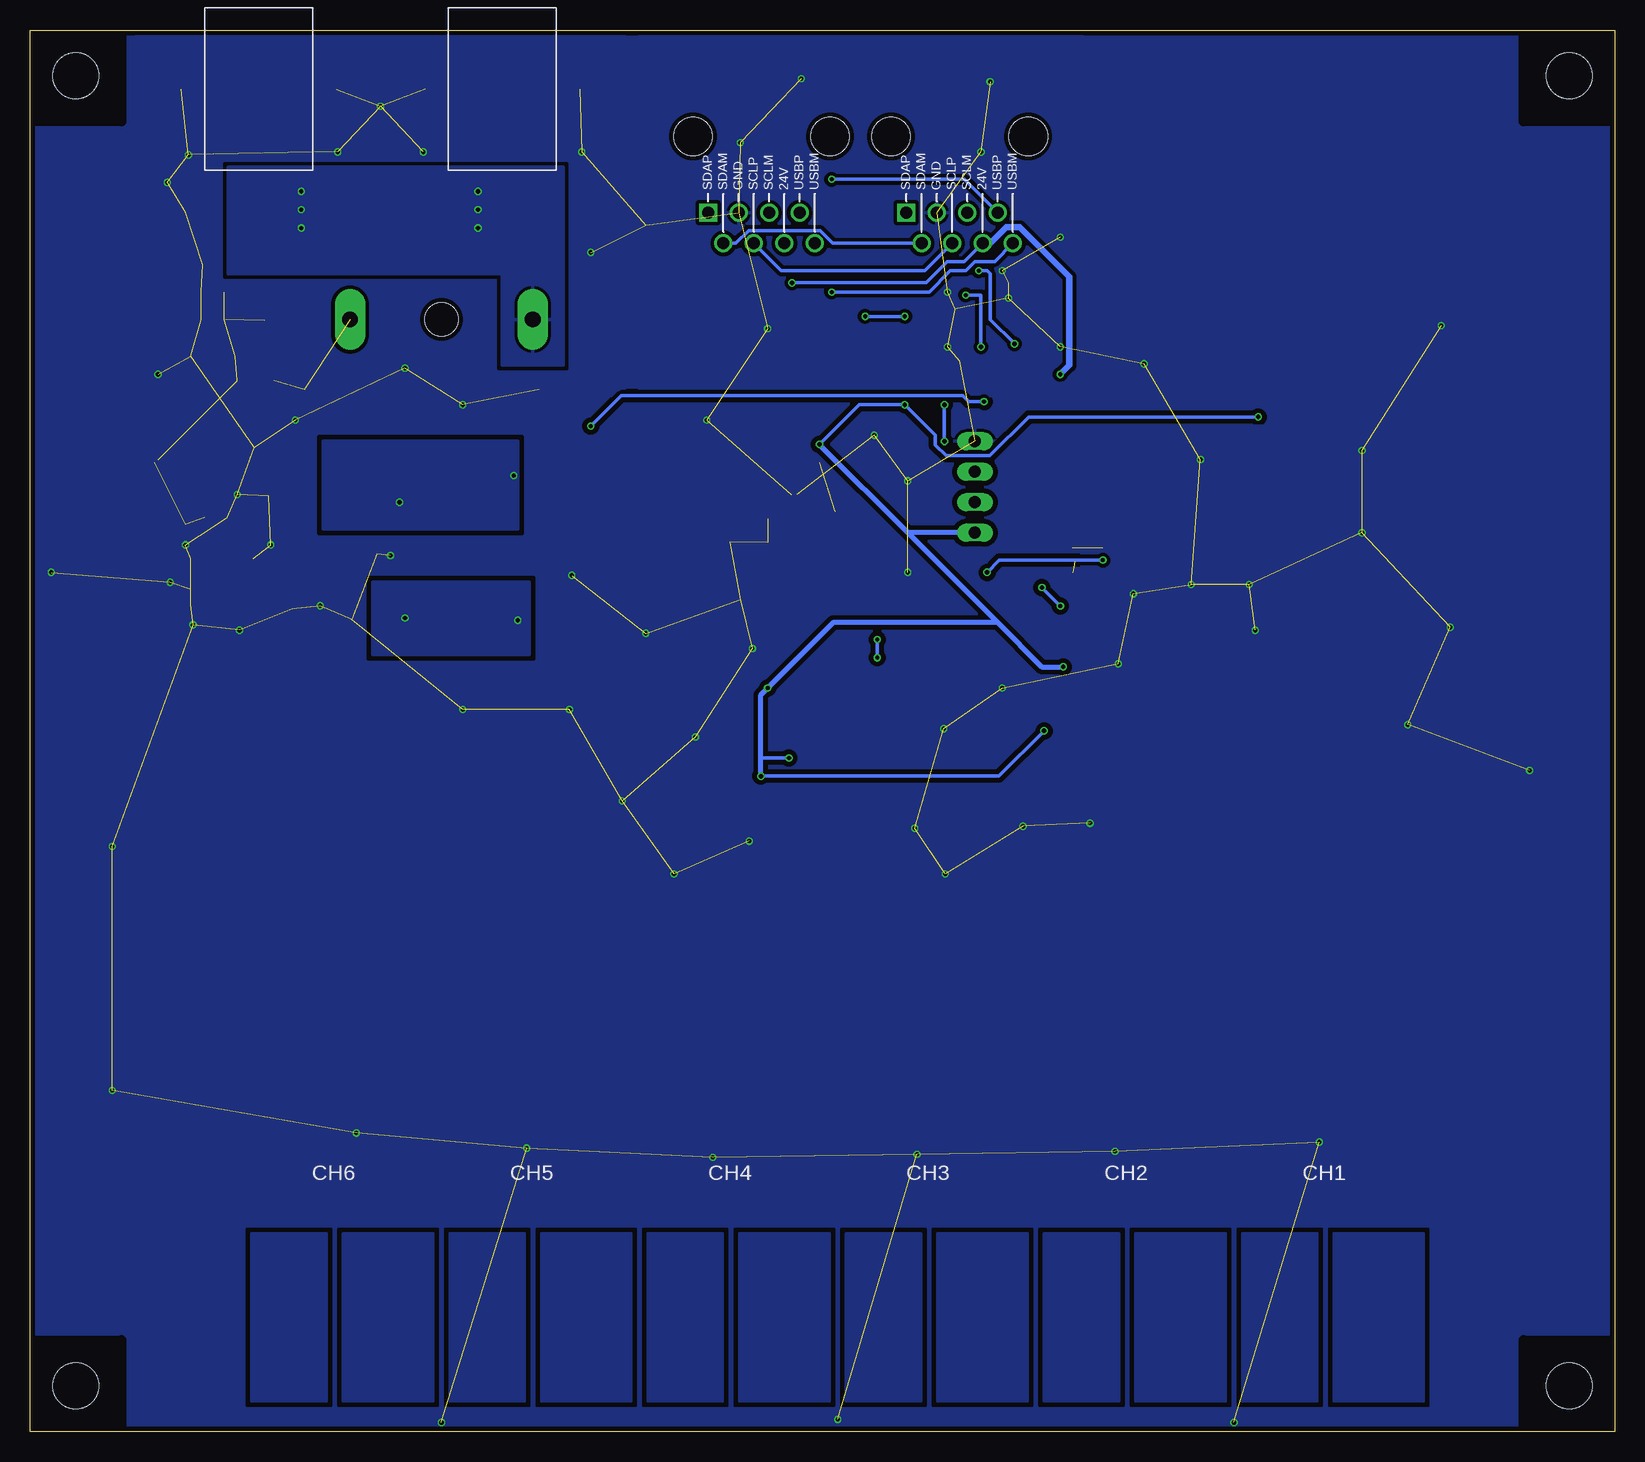
[diagram p3: board, bottom side, seen from below]

Size 132.08 x 116.84 mm. Coordinates in mm from the lower left corner, seen from the top.
Outline: 0,0 132.08,0 132.08,116.84 0,116.84 0,0
Copper layers (1*16): Top 0.035559375mm / dielectric 1.6mm / Bottom 0.035559375mm
Design rules "openag-router": minimum track width 6mil, minimum drill 10mil, track to track 12mil, track to pad 12mil, pad to pad 12mil, via to via 12mil, smd to smd 12mil, copper to edge 15mil, drill to drill 6mil, minimum pad ring 5mil, minimum via ring 5mil, stop-mask expansion 2.5mil, vias tented up to drill 20mil, thermal gap 10mil

### Footprints (pad centres in the part's own frame; a part is rotated, then mirrored left to right if it is on the bottom)
C0603 = smd 1.1 x 1: 1 -0.85,0; 2 0.85,0
C0805 = smd 1.3 x 1.5: 1 -0.95,0; 2 0.95,0
CT7343 = smd 2.6 x 2.4: + -3.2,0; - 3.2,0
CHIPLED_0603 = smd 0.8 x 0.8: A 0,-0.75; C 0,0.75
SMA = smd 2.18 x 1.63: 1 -1.857,0; 2 1.857,0
POWERDI123 = smd 1.05 x 1.5: + -1.3,0 | smd 2.4 x 1.5: - 1.05,0
0603 = smd 0.756 x 0.8: 1 -0.778,0; 2 0.778,0
SS = smd 1.803 x 2.642: 1 -2.629,0; 2 2.629,0
GSH15 = drill 1.321 pad 2.54 long: 1 -7.62,0; 2 7.62,0 | hole 2.794: 0,0
OPENAG-V1-RJ45 = drill 1: 24V(6) 1.905,8.89; DSCLM(5) 0.635,6.35; DSCLP(4) -0.635,8.89; DSDAM(2) -3.175,8.89; GND(3) -1.905,6.35; USBM(8) 4.445,8.89; USBP(7) 3.175,6.35 | drill 1 square: DSDAP(1) -4.445,6.35 | hole 3.2: -5.715,0; 5.715,0
OPENAG-I2C-HEADER = drill 1 long: 3V3 3.81,0; GND -3.81,0; SCL -1.27,0; SDA 1.27,0
PJ-036AH = smd 4.4 x 3.3: 1 2.2,-0.65 | smd 6.75 x 3.9: 2 -6.75,6.45 | smd 6.2 x 3.9: 3 -6.75,-6.45
UP2B = smd 2.311 x 7.29: 1 -5.855,0; 2 5.855,0
RC0603N = smd 0.756 x 0.8: 1 -0.778,0; 2 0.778,0
SOLDERJUMPER_REFLOW_NOPASTE = smd 1.168 x 1.6: 1 -0.762,0; 2 0.762,0
TP06R = smd 0.6 x 0.6: TP 0,0
MP04A = smd 1.6 x 0.838: 1 -3.2,2.3; 2 -3.2,0; 3 -3.2,-2.3 | smd 1.6 x 3.099: 4 3.2,0
SOP50P490X110-10N = smd 1.4 x 0.3: 1 -2.2,1; 2 -2.2,0.5; 3 -2.2,0; 4 -2.2,-0.5; 5 -2.2,-1; 6 2.2,-1; 7 2.2,-0.5; 8 2.2,0; 9 2.2,0.5; 10 2.2,1
SOIC8 = smd 0.6 x 2.2: 1 -1.905,-2.6; 2 -0.635,-2.6; 3 0.635,-2.6; 4 1.905,-2.6; 5 1.905,2.6; 6 0.635,2.6; 7 -0.635,2.6; 8 -1.905,2.6
OPENAG-CORNER-MOUNTING-HOLE = hole 3.81: 0,0

### Placement (x,y rotation side)
C22  70.61,76.96 270 top
C23  70.61,73.15 90 top
C35  116.59,76.2 180 top
C36  108.97,77.98 0 top
C38  116.84,92.71 0 top
C39  116.84,95 0 top
C40  116.84,97.28 0 top
D1  68.2,77.34 0 top
D5  118.36,101.6 270 top
D6  116.84,89.66 0 top
D7  104.2,67.69 0 top
D8  103.95,73.15 90 top
F2  64.26,71.63 180 top
F5  112.52,95.25 270 top
F6  97.79,92.71 0 top
FRAME1  178.82,50.16 0 bottom  (outside the outline)
J4  71.12,107.95 180 top
J7  53.34,78.74 270 top
J8  54.61,107.95 180 top
J9  92.71,105.16 270 top
J10  113.03,105.16 270 top
L8  96.27,73.66 90 top
R11  68.2,73.15 270 top
R13  110.24,72.39 90 top
R32  110.24,69.34 90 top
R33  106.81,73.15 0 top
R40  116.84,99.57 180 top
R42  53.85,89.28 0 top
R43  50.8,89.28 0 top
R44  47.75,89.28 0 top
R45  47.24,91.82 270 top
R46  49.78,95.76 180 top
R47  47.24,94.87 270 top
R48  57.78,92.2 270 top
R49  60.58,92.2 270 top
SJ1  88.14,77.72 180 top
SJ3  64.26,76.71 0 top
SJ4  55.12,68.58 180 top
SJ6  51.56,68.58 180 top
TP1  60.45,87.12 270 top
TP2  61.72,87.12 270 top
TP3  89.66,86.87 180 top
TP4  109.22,86.87 180 top
TP5  56.64,87.12 270 top
TP6  80.77,100.58 270 top
TP7  52.58,87.12 270 top
TP10  46.23,87.12 270 top
TP12  85.34,81.79 0 top
TP13  113.41,82.04 0 top
TP14  121.41,81.03 0 top
TP15  72.9,69.34 0 top
TP16  78.74,80.77 0 top
TP17  66.29,80.77 0 top
U12  76.96,74.17 0 top
U15  52.83,92.58 180 top
U16  116.08,70.87 270 top
U$1  [OPENAG-CORNER-MOUNTING-HOLE]  3.81,3.81 0 top
U$2  [OPENAG-CORNER-MOUNTING-HOLE]  128.27,3.81 90 top
U$3  [OPENAG-CORNER-MOUNTING-HOLE]  128.27,113.03 180 top
U$4  [OPENAG-CORNER-MOUNTING-HOLE]  3.81,113.03 270 top
U$5  [OPENAG-LOGO-1000-MIL]  129.54,11.43 90 top

### Tracks (layer width: path | path; a pad name or v marks a point on that pad's centre or on a via)
24V_IN  (via drill 0.35)
  other vias: 109.47,100.33 109.47,101.85 109.47,103.38 94.74,103.38 94.74,100.33 94.74,101.85
  pour Top (isolate 0.305): 87.63,88.9 87.63,105.41 115.57,105.41 115.57,96.52 92.71,96.52 92.71,88.9
  pour Bottom (isolate 0.305): 115.57,105.41 87.63,105.41 87.63,88.9 92.71,88.9 92.71,96.52 115.57,96.52
!LDAC!
  Top 0.406: 53.85,61.98 53.85,62.48
  pour Top (isolate 0.406): 55.37,61.47 55.37,63.5 52.07,63.5 52.07,61.47
+3V3  (via drill 0.35)  (1 unrouted)
  Top 0.305: 49.88,58.12 49.58,58.42 | 49.58,58.42 v47.57,58.42 | 49.08,58.92 49.58,58.42 | v71.17,54.63 71.17,53.3 | U15.1 56.39,91.58 | 56.39,91.58 57.01,91.58 57.24,91.35 57.71,91.35 R48.2 R49.2 | 56.39,91.58 56.39,87.38 TP5.TP 58.17,85.6 v59.18,85.6 | v66.29,82.3 TP17.TP | v29.72,84.58 28.7,84.58 28.45,84.84 | 73.15,52.07 73.15,50.55 74.16,49.54 | 73.15,52.07 73.15,54.65 | 73.15,52.07 73.91,52.07 74.64,52.79
  Top 0.356: 73.15,54.65 71.18,54.65 v71.17,54.63
  Top 0.406: v47.57,58.41 v47.57,58.42 | v45.97,63.75 45.47,64.26 45.47,65.28
  Bottom 0.305: v47.57,58.42 51.36,54.63 v71.17,54.63 | v66.29,82.3 62.99,85.6 v59.18,85.6 56.64,83.06 56.64,82.24 55.75,81.34 52.09,81.34 48.85,84.58 v29.72,84.58 | v68.83,56.15 71.15,56.15 71.17,56.13
  Bottom 0.406: v71.17,54.63 71.17,56.13 71.17,61.42 v70.61,61.98 65.15,67.44 51.44,67.44 | v45.97,63.75 47.75,63.75 51.44,67.44 | v66.29,82.3 58.93,74.93 | 58.93,74.93 51.44,67.44 | J7.3V3 58.93,74.93
  pour Top (isolate 0.406): 67.56,63.5 70.87,63.5 70.87,61.21 67.56,61.21
  pour Top: 69.09,81.28 69.09,76.58 59.69,76.58 59.69,81.28
+5V  (via drill 0.35)
  Top 0.305: U15.10 49.16,91.58 48.51,90.93 47.28,90.93 R45.2 47.24,90.17 46.97,89.9 R44.1 46.97,88.92 47.75,88.14 51.56,88.14 TP7.TP v52.58,85.85 | v85.34,83.82 TP12.TP
  Bottom 0.305: v52.58,85.85 53.85,85.85 54.36,86.36 82.8,86.36 v85.34,83.82
  pour Top (isolate 0.305): 83.82,75.18 90.68,75.18 90.68,82.55 83.82,82.55
+24V  (9 unrouted)
  Top 0.559: C40.1 115.99,99.57 R40.2 | U16.2 115,71.5 119.13,75.63 119.13,75.69 | 121.67,80.77 TP14.TP
  Top 0.66: C39.1 115.89,97.28 C40.1
  Top 1.27: 114.81,87.63 111.76,87.63
  pour Top (isolate 0.406): 115.57,38.86 115.57,45.72 15.88,45.47 15.88,38.86
  pour Top (isolate 0.406): 100.58,63.5 100.58,38.86 121.92,38.86 121.92,63.5
  pour Top (isolate 0.305): 102.87,86.36 102.87,95.25 116.84,95.25 116.84,86.36
  pour Top: 121.92,82.55 116.65,82.55 116.65,75.25 121.92,75.25
  pour Top (isolate 0.305): 116.84,81.28 121.92,81.28 121.92,82.55
  pour Top (isolate 0.305): 111.76,86.36 116.84,81.28 121.92,81.28 121.92,82.55 116.84,87.63 111.76,87.63
  pour Top (isolate 0.305): 120.65,82.55 120.65,74.93 123.19,74.93 123.19,63.5 120.65,63.5 120.65,57.15 128.27,57.15 128.27,82.55
CH1+
  pour Bottom (isolate 0.406): 24.77,2.54 24.77,16.51 31.11,16.51 31.11,2.54
  pour Top (isolate 0.406): 24.77,2.54 24.77,16.51 31.11,16.51 31.11,2.54
CH1-
  pour Top (isolate 0.406): 15.88,2.54 15.88,16.51 23.5,16.51 23.5,2.54
  pour Bottom (isolate 0.406): 15.88,2.54 15.88,16.51 23.5,16.51 23.5,2.54
CH2+
  pour Bottom (isolate 0.406): 41.27,2.54 41.27,16.51 47.62,16.51 47.62,2.54
  pour Top (isolate 0.406): 41.27,2.54 41.27,16.51 47.62,16.51 47.62,2.54
CH2-
  pour Top (isolate 0.406): 32.38,2.54 32.38,16.51 40.01,16.51 40.01,2.54
  pour Bottom (isolate 0.406): 32.38,2.54 32.38,16.51 40.01,16.51 40.01,2.54
CH3+
  pour Bottom (isolate 0.406): 57.78,2.54 57.78,16.51 64.14,16.51 64.14,2.54
  pour Top (isolate 0.406): 57.78,2.54 57.78,16.51 64.14,16.51 64.14,2.54
CH3-
  pour Top (isolate 0.406): 48.9,2.54 48.9,16.51 56.52,16.51 56.52,2.54
  pour Bottom (isolate 0.406): 48.9,2.54 48.9,16.51 56.52,16.51 56.52,2.54
CH4+
  pour Bottom (isolate 0.406): 74.3,2.54 74.3,16.51 80.64,16.51 80.64,2.54
  pour Top (isolate 0.406): 74.3,2.54 74.3,16.51 80.64,16.51 80.64,2.54
CH4-
  pour Top (isolate 0.406): 65.41,2.54 65.41,16.51 73.03,16.51 73.03,2.54
  pour Bottom (isolate 0.406): 65.41,2.54 65.41,16.51 73.03,16.51 73.03,2.54
CH5+
  pour Bottom (isolate 0.406): 90.81,2.54 90.81,16.51 97.16,16.51 97.16,2.54
  pour Top (isolate 0.406): 90.81,2.54 90.81,16.51 97.16,16.51 97.16,2.54
CH5-
  pour Top (isolate 0.406): 81.92,2.54 81.92,16.51 89.53,16.51 89.53,2.54
  pour Bottom (isolate 0.406): 81.92,2.54 81.92,16.51 89.53,16.51 89.53,2.54
CH6+
  pour Bottom (isolate 0.406): 107.31,2.54 107.31,16.51 113.67,16.51 113.67,2.54
  pour Top (isolate 0.406): 107.31,2.54 107.31,16.51 113.67,16.51 113.67,2.54
CH6-
  pour Top (isolate 0.406): 98.42,2.54 98.42,16.51 106.05,16.51 106.05,2.54
  pour Bottom (isolate 0.406): 98.42,2.54 98.42,16.51 106.05,16.51 106.05,2.54
DAC_!CLR!
  pour Top (isolate 0.406): 59.44,63.5 55.88,63.5 55.88,61.47 59.44,61.47
DSCLM
  Top 0.305: R47.1 47.28,95.76 48.77,95.76 | 48.77,95.76 R46.2 48.93,96.69 50.1,97.85 50.66,97.85 51.37,98.56 51.37,99.89 51.82,100.33 52.7,100.33 J8.DSCLM(5) 57.53,105.16 66.93,105.16 J4.DSCLM(5) | U15.6 49.16,93.58 48.77,93.98 48.77,95.76
DSCLP
  Top 0.305: R47.2 R45.1 48.28,92.6 48.77,93.08 U15.7 51.81,93.08 52.07,93.34 52.07,96.9 52.7,97.54 53.72,97.54 J8.DSCLP(4)
  Bottom 0.305: J4.DSCLP(4) 69.47,96.77 57.53,96.77 J8.DSCLP(4)
DSDAM  (via drill 0.35)
  Top 0.305: 53.34,94.74 53.34,92.84 52.32,92.08 U15.9 | R43.2 R42.1 arc-90 52.83,89.45 v52.83,90.42 52.83,90.55 | v54.1,94.74 53.34,94.74 | 53.34,94.74 53.34,95 54.1,95.76 54.86,95.76 57.78,98.68 J8.DSDAM(2)
  Bottom 0.305: v52.83,90.42 52.83,94.74 v54.1,94.74 | J4.DSDAM(2) 73.25,99.06 72.19,100.11 66.24,100.11 65.18,99.06 J8.DSDAM(2)
DSDAP  (via drill 0.35)
  Top 0.305: R44.2 R43.1 50.02,90.66 v50.04,90.68 | 53.59,96.52 52.7,95.63 52.7,93.34 52.65,93.17 52.07,92.58 U15.8 | 53.59,96.52 54.61,96.52 56.52,98.42 56.52,99.69 57.28,100.46 57.91,100.46 J8.DSDAP(1) 65.79,101.6 67.06,100.33 74.3,100.33 J4.DSDAP(1) | 53.59,96.52 53.34,96.78 v53.02,96.78
  Bottom 0.305: v50.04,90.68 52.07,92.71 52.07,96.52 52.33,96.78 v53.02,96.78
GND  (via drill 0.35)  (105 unrouted)
  Top 0.406: D1.C 68.63,78.09 C22.2
  other vias: 39.24,89 58.34,50.29 76.63,57.91 72.14,49.23 55.93,58.6 82.73,52.58 118.87,106.43 106.43,106.68 99.31,106.68 86.11,106.68 102.87,110.49 85.34,98.3 100.84,88.65 121.41,88.14 120.65,104.14 55.63,95 55.63,90.42 50.55,94.49 51.05,96.77 46.23,90.42 46.23,99.57 52.07,112.52 52.83,106.68 67.82,112.78 72.9,107.44 112.01,73.91 119.13,73.91 102.04,73.03 107.89,68.83 118.49,67.25 120.4,70.8 114.62,66.8 86.93,71.37 114.81,78.11 21.08,74.93 35.31,70.61 30.48,70.61 29.97,66.8 40.13,69.85 13.72,67.06 34.54,81.03 21.08,81.79 24.64,24.13 41.66,23.37 58.17,23.11 75.18,22.86 90.68,23.62 104.9,24.89 17.27,58.93 7.11,55.12 71.88,65.28 80.77,66.55 87.12,60.2 96.01,60.2 61.72,83.06 75.69,84.33 70.61,91.95 109.98,84.33 96.01,85.6 125.22,48.77 125.22,28.45 31.75,0.76 41.4,64.01 51.05,61.98 43.74,50.72 49.33,50.47 55.8,46.48 78.41,46.48 64.77,1.02 97.79,0.76 130.3,71.63 14.48,92.2 58.93,71.63 58.93,79.25
  pour Top (isolate 0.406, rank 3): 0,0 132.08,0 132.08,116.84 0,116.84
  pour Bottom (isolate 0.406, rank 3): 0,0 132.08,0 132.08,116.84 0,116.84
  pour Top (isolate 0.305, rank 2): 82.55,86.36 82.55,120.65 123.19,120.65 123.19,86.36
  pour Bottom (isolate 0.305, rank 3): 82.55,86.36 123.19,86.36 123.19,120.65 82.55,120.65
  pour Top (isolate 0.305): 44.45,120.65 44.45,86.36 81.28,86.36 81.28,120.65
  pour Bottom (isolate 0.305): 44.45,86.36 81.28,86.36 81.28,120.65 44.45,120.65
  pour Top (isolate 0.406, rank 2): 83.82,64.77 121.92,64.77 121.92,82.55 83.82,82.55
  pour Bottom (isolate 0.406, rank 2): 83.82,64.77 121.92,64.77 121.92,82.55 83.82,82.55
  pour Top (isolate 0.305, no thermals): 117.47,73.34 120.21,73.34 120.21,68.26 117.47,68.26
  pour Top (isolate 0.406, rank 3): 59.69,81.28 59.69,68.58 82.55,68.58 82.55,81.28
  pour Top (isolate 0.305, rank 2): 10.16,64.77 44.45,64.77 44.45,83.82 10.16,83.82
  pour Bottom (isolate 0.305): 44.45,83.82 10.16,83.82 10.16,64.77 44.45,64.77
LIN_REG_VIN
  pour Top: 69.98,81.28 69.98,76.83 82.55,76.83 82.55,81.28
N$1
  pour Top (isolate 0.406): 24.77,25.4 24.77,38.1 32.38,38.1 32.38,25.4
N$2
  pour Top (isolate 0.406): 41.27,25.4 41.27,38.1 48.9,38.1 48.9,25.4
N$4
  pour Top (isolate 0.406): 57.78,25.4 57.78,38.1 65.41,38.1 65.41,25.4
N$5
  pour Top (isolate 0.406): 74.3,25.4 74.3,38.1 81.92,38.1 81.92,25.4
N$6
  pour Top (isolate 0.406): 90.81,25.4 90.81,38.1 98.42,38.1 98.42,25.4
N$7
  pour Top (isolate 0.406): 107.31,25.4 107.31,38.1 115.57,38.1 115.57,25.4
N$10
  Top 0.61: D1.A R11.1
N$11  (via drill 0.35)
  Top 0.559: 110.35,70.23 U16.3 U16.4 | 110.35,70.23 R32.2 | 101.92,68.28 101.92,69.85 102.3,70.23 110.35,70.23
  Top 0.61: R13.1 R32.2
  other vias: 100.84,67.82 91.44,67.63
  pour Top (isolate 0.305): 90.42,70.87 90.42,64.77 103.63,64.77 103.63,70.87
  pour Bottom (isolate 0.305): 90.49,64.77 90.49,70.8 103.5,70.8 103.5,64.77
N$12
  Top 0.61: 70.79,71.87 C23.1 | C23.1 70.95,71.87 U12.3 | F2.1 65.8,70.87 69.28,70.87 C23.1
N$22
  Top 0.559: R33.1 D8.A
N$24  (via drill 0.35)
  Top 0.559: 100.83,79.52 102.11,78.23 | R13.2 107.6,73.17 R33.2 107.58,74.03 106.95,74.66 106.95,75.93 106.68,76.2 | SJ1.1 91.69,77.72
  Top 0.61: SJ1.1 88.92,77.74
  other vias: 101.28,77.47 91.76,79.69
  pour Top: 91.44,82.55 91.44,75.25 107.63,75.25 107.63,82.55
  pour Bottom (isolate 0.305): 91.44,82.55 91.44,75.25 107.63,75.25 107.63,82.55
N$26
  Top 0.559: R40.1 D5.A
N/C  (via drill 0.35)
  Top 0.305: J4.24V(6) 69.22,96.39 v68.58,95.76
  Top 0.559: v46.23,88.14 TP10.TP
  Bottom 0.305: 52.05,99.06 J8.24V(6) 54.23,97.54 55.63,97.54 57.4,95.76 v68.58,95.76
  Bottom 0.559: 52.05,99.06 50.72,100.39 49.59,100.39 45.47,96.27 45.47,88.9 v46.23,88.14
REG_3V3_400MA
  Top 0.61: SJ3.1 63.48,72.9 | 63.48,72.9 F2.2 | R11.2 67.83,72.37 67.31,72.9 63.48,72.9
SCL  (via drill 0.35)  (1 unrouted)
  Top 0.305: v61.47,64.52 61.47,62.48 | 54.36,66.04 50.72,66.04 45.12,71.63 | 54.36,66.04 v61.47,66.04 | SJ4.2 54.36,66.04 | J7.SCL 52.42,80.01 44.96,72.54
  Bottom 0.305: v61.47,66.04 v61.47,64.52
  pour Top (isolate 0.406): 59.94,63.5 59.94,61.47 63.25,61.47 63.25,63.5
SCL_IN  (via drill 0.35)
  Top 0.305: U15.4 56.25,93.08 57.4,94.23 60.2,94.23 60.58,93.85 R49.1 60.59,92.96 61.47,92.96 61.72,92.71 61.72,90.93 60.45,89.66 TP1.TP 60.45,85.09 59.94,84.58 55.88,84.58 | 49.53,78.99 49.53,83.31 50.8,84.58 55.88,84.58 | SJ4.1 v55.88,82.55 | v55.88,85.6 55.88,84.58
  Bottom 0.305: v55.88,82.55 v55.88,85.6
SDA  (via drill 0.35)
  Top 0.305: 65.28,62.99 62.99,65.28 50.55,65.28 49.78,66.04 | 49.78,66.04 46.61,69.22 v46.21,68.82 | 49.78,65.89 49.78,66.04 | SJ6.2 49.53,68.58 v47.75,70.36 47.75,74.17 51.05,77.47 J7.SDA
  Bottom 0.305: v47.75,70.36 v46.21,68.82
  pour Top (isolate 0.406): 63.75,63.5 67.06,63.5 67.06,61.47 63.75,61.47
SDA_IN  (via drill 0.35)  (1 unrouted)
  Top 0.305: U15.2 56.27,92.08 57.17,92.98 R48.1 59.17,92.98 v59.18,92.96 | v62.48,92.96 62.33,92.81 62.33,90.68 61.21,89.56 61.21,87.63 TP2.TP 61.72,85.34 60.15,83.77 50.85,83.77 50.14,83.06 50.14,78.59 45.21,73.66 | 41.66,72.64 42.16,73.15 | 42.16,73.15 42.67,73.66 | 42.16,73.15 v42.67,72.64 | v52.32,71.63 SJ6.1
  Bottom 0.305: v59.18,92.96 v62.48,92.96 | v42.67,72.64 51.31,72.64 v52.32,71.63
USBM  (via drill 0.35)
  Top 0.305: v65.28,95 66.67,96.39 J4.USBM(8)
  Bottom 0.305: v65.28,95 57.15,95 55.37,96.77 54.1,96.77 53.33,97.54 51.69,97.54 J8.USBM(8)
USBP  (via drill 0.35)
  Top 0.305: v65.28,104.39 67.94,101.73 J4.USBP(7)
  Bottom 0.305: v65.28,104.39 54.23,104.39 J8.USBP(7)

### Text on the board
tPlace: EDGE | EDGE | EDGE | GND | GND | GND | GND | GND | 3V3 | RS485 | 24V | 5V | 3V3 | SCL | SDA | GND | 24V | RS485 Connection Pair w/UART Transceiver | Barrel Jack Connector Pair w/24V / Conditioning + Fuse + Indicator LED | I2C Header | RJ45 Connector Pair w/dI2C Buffer | GND | 5V | NC | GND | 24V | 3.3V | VIN | Enable | Enable | RS485 / Enable | RS485 | Fuse | EDGE | I2C-IN | I2C / Enable | Programming Header | I2C | GND | IO | SDA | SCL | GND | PSOC4100: 32-bit 24MHz / ARM-M0 Microcontroller | 5-26V to 3.3V@400mA Regulator / w/3v3 Enable, Indicator LED & Fuse | PSOC4100 Microcontroller / w/I2C or RS485 Communication | GND | 3V3 | I2C Connect | NC | GND | 24V-to-5V@1A Switching Regulator / w/Indicator LED + Enable | GND | LDAC | CLR | SCL | SDA | 3.3V | GND | PCA9685 Address Set | DAC5578 Address Set | 24V | 1+ | A5 | A4 | A3 | A2 | A1 | A0 | +RW | Default | 0x4c | 0x4a | 0x48 | LDAC / HW-EN | PCA9685: 16-Channel, / 12-bit FM+ I2C PWM Driver | DAC5578: 8-Channel, / 8-bit I2C DAC | GND | Light Controller v2.0 | EDGE | 6-Channel 24V, 700mA (per channel) Current Regulator Module w/I2C Controlled Dimming via PWM or Analog Signaling
bPlace: CH1 | CH2 | CH3 | CH4 | CH5 | CH6